# Altium project CYUSB.PrjPcb
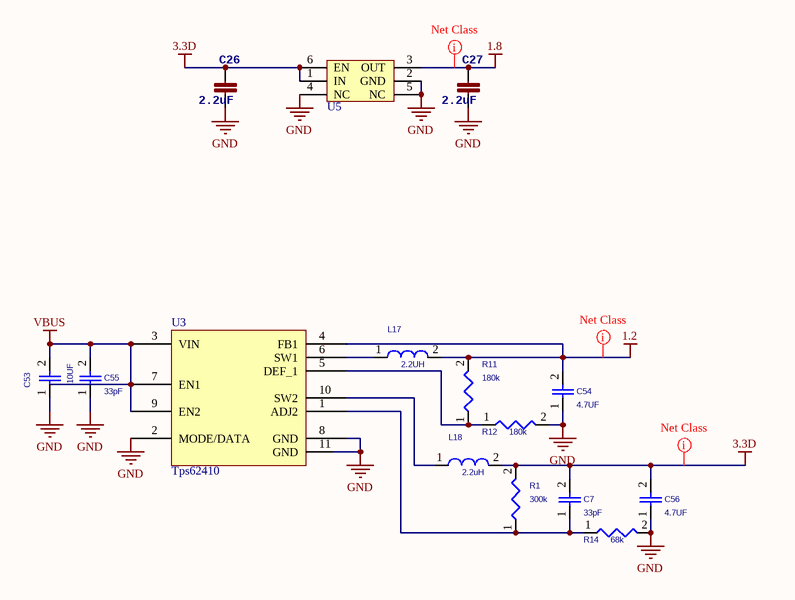
[diagram p0: power.SchDoc]
8 sheets, 127 parts. Net scope: flat (ports and power ports of the same name join across sheets).
Board file: CYUSB.PcbDoc
Sheets:
  power.SchDoc
  USB_TYPE_C.SchDoc
  CYUSB_IO.SchDoc
  CYUSB.SchDoc
  FPGA_IO_Interface.SchDoc
  FPGA_IO_CYUSB.SchDoc
  FPGA_Configuration_power.SchDoc
  connector.SchDoc

## Sheet power.SchDoc
size A4

### Parts
C7  33pF  [0402]
C26  2.2uF  [0402]
C27  2.2uF  [0402]
C53  10UF  [0805]
C54  4.7UF  [0805]
C55  33pF  [0402]
C56  4.7UF  [0805]
L17  2.2UH  [0806]
L18  2.2uH  [0806]
R1  300k  [0402]
R11  180k  [0402]
R12  180k  [0402]
R14  68k  [0402]
U3  Tps62410  [DFN-10P-3X3]
U5  TLV700xx-WSON  [WSON]  (value not drawn)

### Nets
1.2: C54.2 L17.2 R11.2 U3.4(FB1)
1.8: C27.2 U5.3(OUT)
3.3D: C7.2 C26.2 C56.2 L18.2 R1.2 U5.1(IN) U5.6(EN)
GND: C26.1 C27.1 C53.1 C54.1 C55.1 C56.1 R12.2 R14.2 U3.2(MODE/DATA) U3.8(GND) U3.11(GND) U5.2(GND) U5.4(NC) U5.5(NC)
VBUS: C53.2 C55.2 U3.3(VIN) U3.7(EN1) U3.9(EN2)
NetC7_1: C7.1 R1.1 R14.1 U3.1(ADJ2)
NetL17_1: L17.1 U3.6(SW1)
NetL18_1: L18.1 U3.10(SW2)
NetR11_1: R11.1 R12.1 U3.5(DEF_1)

### Layout directives
net class Power: 1.2, 1.8, 3.3D

### Library data of the parts
C7 C55 = CAP/0402: 1st Part Field: 0402
C26 C27 = CAP0402-CAP: <b>Capacitor</b> / Standard 0603 ceramic capacitor, and 0.1" leaded capacitor.; PARTNO: CC0402ZRY5V7BB104
C53 C54 C56 = CAP/0402: 1st Part Field: 0402
L17 L18 = L/2.5*2.0
R1 R11 R12 R14 = RES/0402_3

## Sheet USB_TYPE_C.SchDoc
size A4
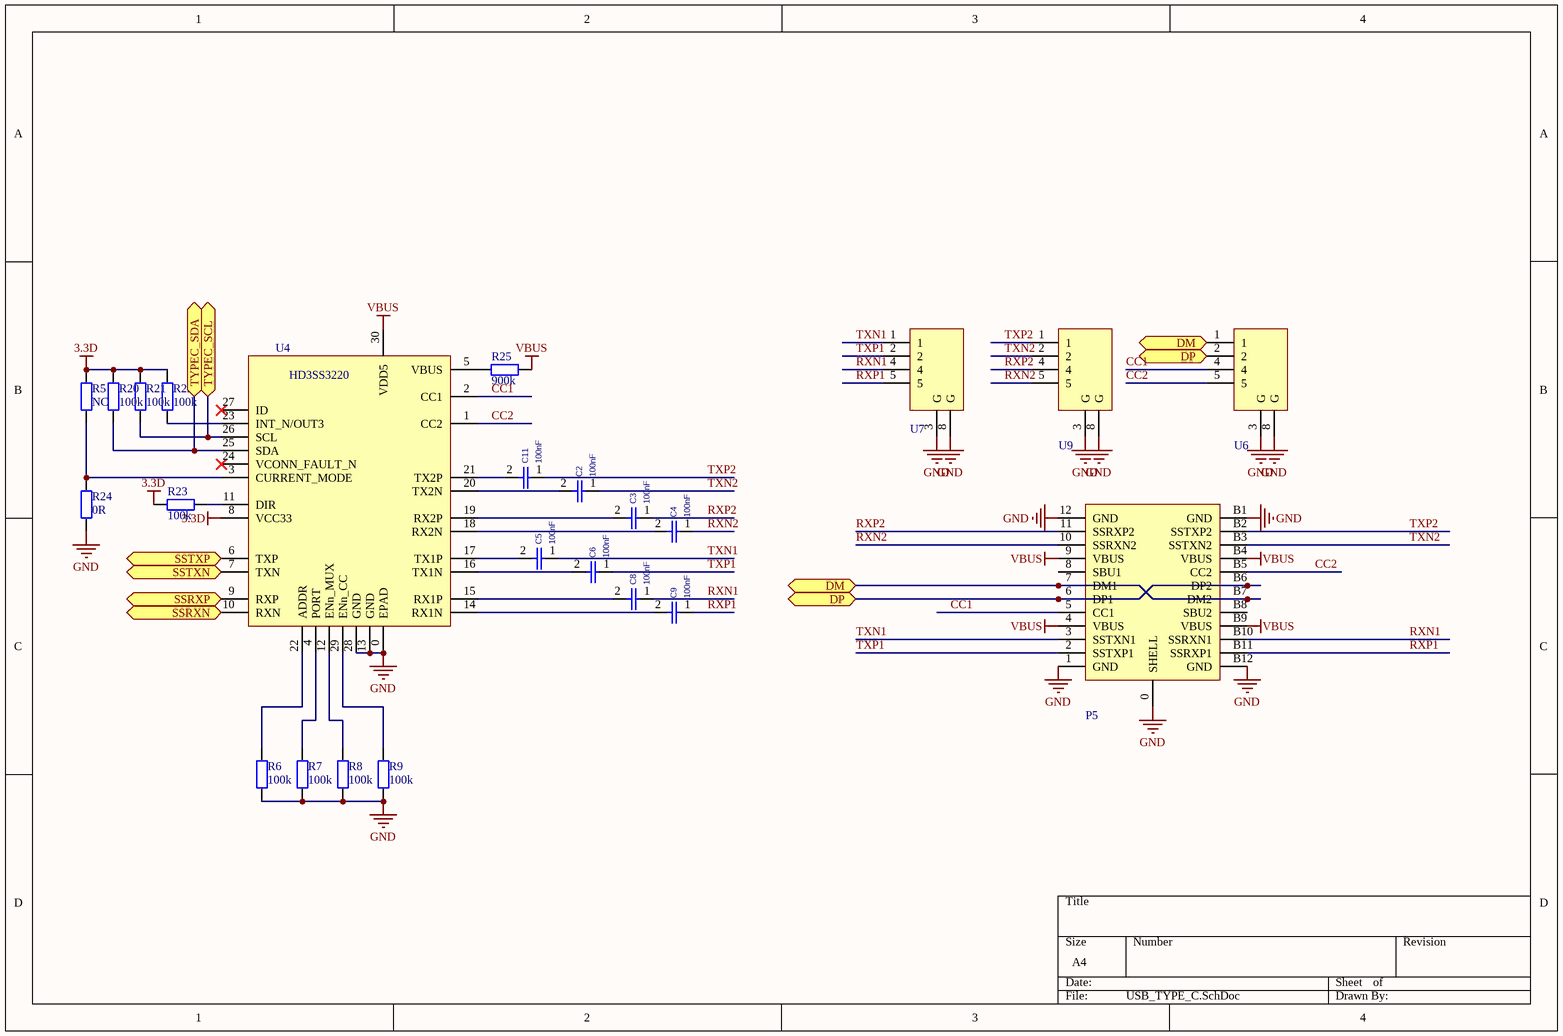
[diagram p1: USB_TYPE_C.SchDoc]

### Parts
C2  100nF  [0201]
C3  100nF  [0201]
C4  100nF  [0201]
C5  100nF  [0201]
C6  100nF  [0201]
C8  100nF  [0201]
C9  100nF  [0201]
C11  100nF  [0201]
P5  TYPEC  [TYPEC]  (value not drawn)
R5  NC  [0201]
R6  100k  [0201]
R7  100k  [0201]
R8  100k  [0201]
R9  100k  [0201]
R20  100k  [0201]
R21  100k  [0201]
R22  100k  [0201]
R23  100k  [0201]
R24  0R  [0201]
R25  900k  [0201]
U4  HD3SS3220  [HD3SS3220]
U6  PUSB3FR4  [PUSB3FR4]  (value not drawn)
U7  PUSB3FR4  [PUSB3FR4]  (value not drawn)
U9  PUSB3FR4  [PUSB3FR4]  (value not drawn)

### Ports
DM, DP, SSRXN, SSRXP, SSTXN, SSTXP, TYPEC_SCL, TYPEC_SDA

### Nets
3.3D: R5.2 R20.2 R21.2 R22.2 R23.1 U4.8(VCC33)
GND: P5.0(SHELL) P5.1(GND) P5.12(GND) P5.B1(GND) P5.B12(GND) R6.1 R7.1 R8.1 R9.1 R24.1 U4.0(EPAD) U4.13(GND) U4.28(GND) U6.3(G) U6.8(G) U7.3(G) U7.8(G) U9.3(G) U9.8(G)
VBUS: P5.4(VBUS) P5.9(VBUS) P5.B4(VBUS) P5.B9(VBUS) R25.2 U4.30(VDD5)
CC1: P5.5(CC1) U4.2(CC1) U6.4
CC2: P5.B5(CC2) U4.1(CC2) U6.5
RXN1: C8.1 P5.B10(SSRXN1) U7.4
RXN2: C4.1 P5.10(SSRXN2) U9.5
RXP1: C9.1 P5.B11(SSRXP1) U7.5
RXP2: C3.1 P5.11(SSRXP2) U9.4
TXN1: C5.1 P5.3(SSTXN1) U7.1
TXN2: C2.1 P5.B3(SSTXN2) U9.2
TXP1: C6.1 P5.2(SSTXP1) U7.2
TXP2: C11.1 P5.B2(SSTXP2) U9.1
NetC2_2: C2.2 U4.20(TX2N)
NetC3_2: C3.2 U4.19(RX2P)
NetC4_2: C4.2 U4.18(RX2N)
NetC5_2: C5.2 U4.17(TX1P)
NetC6_2: C6.2 U4.16(TX1N)
NetC8_2: C8.2 U4.15(RX1P)
NetC9_2: C9.2 U4.14(RX1N)
NetC11_2: C11.2 U4.21(TX2P)
NetP5_6: P5.6(DP1) P5.B6(DP2) U6.2 ; port DP
NetP5_7: P5.7(DM1) P5.B7(DM2) U6.1 ; port DM
NetR4_1: R21.1 U4.26(SCL) ; port TYPEC_SCL
NetR5_1: R5.1 R24.2 U4.3(CURRENT_MODE)
NetR6_2: R6.2 U4.22(ADDR)
NetR7_2: R7.2 U4.4(PORT)
NetR8_2: R8.2 U4.12(ENn_MUX)
NetR9_2: R9.2 U4.29(ENn_CC)
NetR18_1: R20.1 U4.25(SDA) ; port TYPEC_SDA
NetR22_1: R22.1 U4.23(INT_N/OUT3)
NetR23_2: R23.2 U4.11(DIR)
NetR25_1: R25.1 U4.5(VBUS)
NetU1_A3: U4.10(RXN) ; port SSRXN
NetU1_A4: U4.9(RXP) ; port SSRXP
NetU1_A5: U4.6(TXP) ; port SSTXP
NetU1_A6: U4.7(TXN) ; port SSTXN

Not connected (* = marked no-connect by the designer): P5 8(SBU1) B8(SBU2); U4 24(VCONN_FAULT_N)* 27(ID)*

### Library data of the parts
C2-C6 C8 C9 C11 = CAP/0402: 1st Part Field: 0402
R5-R9 R20-R25 = Res2: Resistor; Published: 8-Jun-2000; LatestRevisionDate: 17-Jul-2002; LatestRevisionNote: Re-released for DXP Platform.; PackageReference: AXIAL-0.4; Publisher: Altium Limited; PackageDescription: Axial Device, Thru-Hole; 2 Leads; 0.4 in Pin Spacing

## Sheet CYUSB_IO.SchDoc
size A3
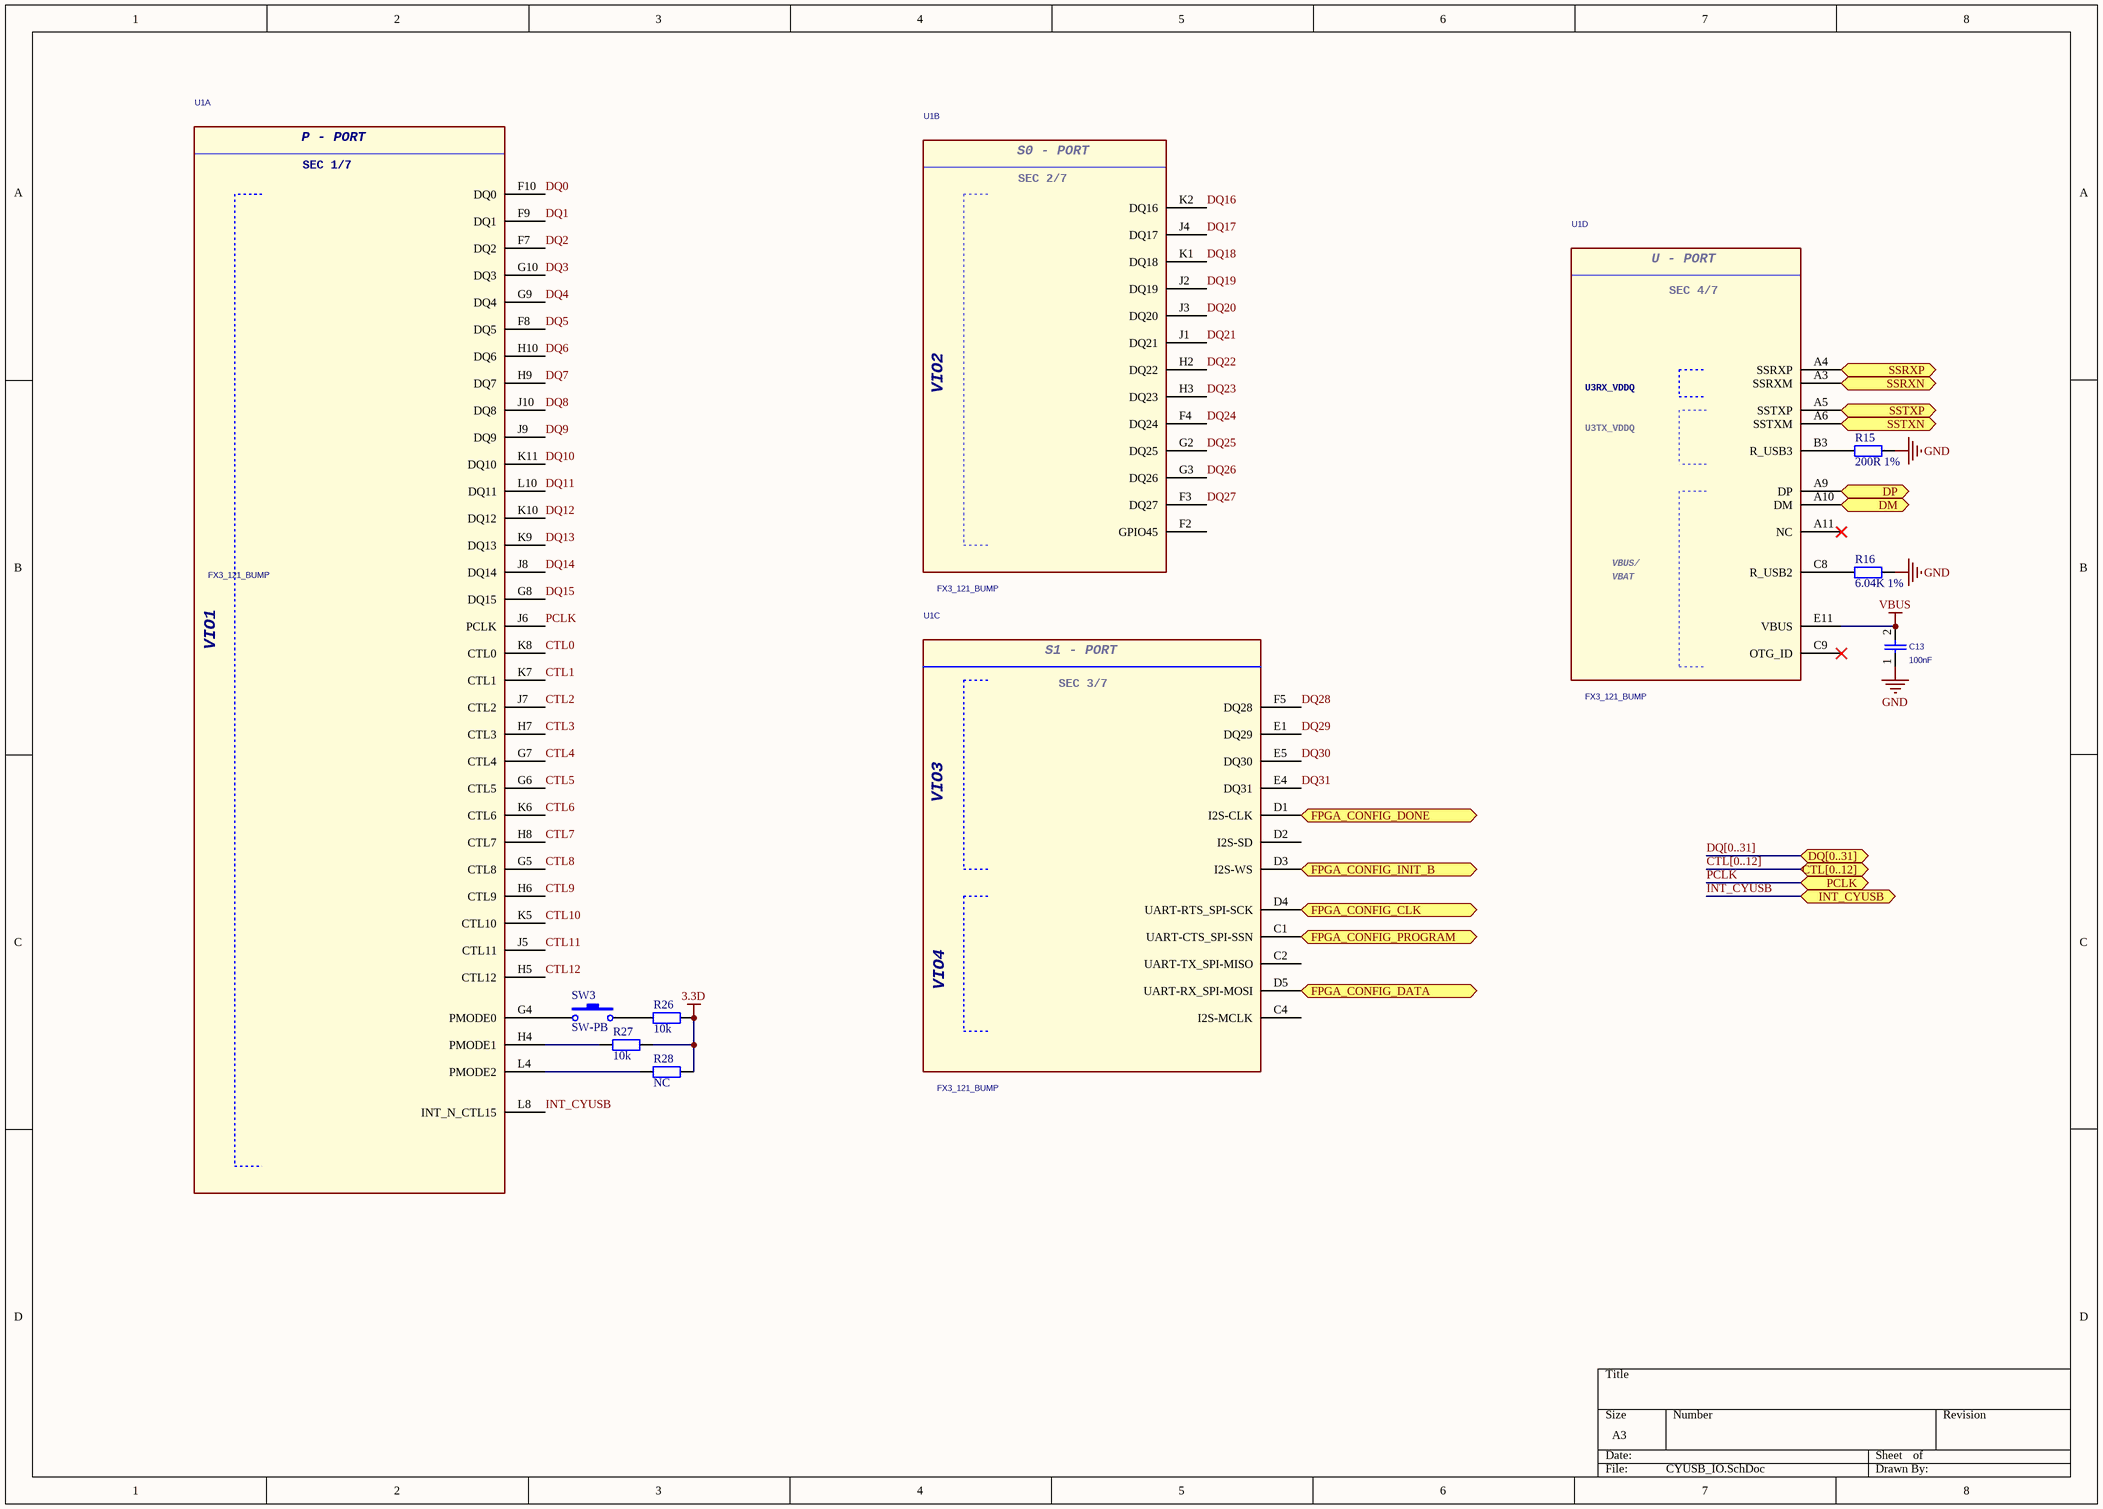
[diagram p2: CYUSB_IO.SchDoc]

### Parts
C13  100nF  [0201]
R15  200R 1%  [0201]
R16  6.04K 1%  [0201]
R26  10k  [0201]
R27  10k  [0201]
R28  NC  [0201]
SW3  SW-PB  [SW-SIDE]
U1  FX3_121_BUMP  [FX3_121_BUMP]  (parts A,B,C,D of 8)

### Ports
CTL[0..12], DM, DP, DQ[0..31], FPGA_CONFIG_CLK, FPGA_CONFIG_DATA, FPGA_CONFIG_DONE, FPGA_CONFIG_INIT_B, FPGA_CONFIG_PROGRAM, INT_CYUSB, PCLK, SSRXN, SSRXP, SSTXN, SSTXP

### Nets
3.3D: R26.1 R27.1 R28.1
GND: C13.1 R15.2 R16.2
VBUS: C13.2 U1.E11(VBUS)
CCLK: U1.D4(UART-RTS_SPI-SCK) ; port FPGA_CONFIG_CLK
CTL0: U1.K8(CTL0)
CTL1: U1.K7(CTL1)
CTL2: U1.J7(CTL2)
CTL3: U1.H7(CTL3)
CTL4: U1.G7(CTL4)
CTL5: U1.G6(CTL5)
CTL6: U1.K6(CTL6)
CTL7: U1.H8(CTL7)
CTL8: U1.G5(CTL8)
CTL9: U1.H6(CTL9)
CTL10: U1.K5(CTL10)
CTL11: U1.J5(CTL11)
CTL12: U1.H5(CTL12)
DATA: U1.D5(UART-RX_SPI-MOSI) ; port FPGA_CONFIG_DATA
DONE: U1.D1(I2S-CLK) ; port FPGA_CONFIG_DONE
DQ0: U1.F10(DQ0)
DQ1: U1.F9(DQ1)
DQ2: U1.F7(DQ2)
DQ3: U1.G10(DQ3)
DQ4: U1.G9(DQ4)
DQ5: U1.F8(DQ5)
DQ6: U1.H10(DQ6)
DQ7: U1.H9(DQ7)
DQ8: U1.J10(DQ8)
DQ9: U1.J9(DQ9)
DQ10: U1.K11(DQ10)
DQ11: U1.L10(DQ11)
DQ12: U1.K10(DQ12)
DQ13: U1.K9(DQ13)
DQ14: U1.J8(DQ14)
DQ15: U1.G8(DQ15)
DQ16: U1.K2(DQ16)
DQ17: U1.J4(DQ17)
DQ18: U1.K1(DQ18)
DQ19: U1.J2(DQ19)
DQ20: U1.J3(DQ20)
DQ21: U1.J1(DQ21)
DQ22: U1.H2(DQ22)
DQ23: U1.H3(DQ23)
DQ24: U1.F4(DQ24)
DQ25: U1.G2(DQ25)
DQ26: U1.G3(DQ26)
DQ27: U1.F3(DQ27)
DQ28: U1.F5(DQ28)
DQ29: U1.E1(DQ29)
DQ30: U1.E5(DQ30)
DQ31: U1.E4(DQ31)
INIT_B: U1.D3(I2S-WS) ; port FPGA_CONFIG_INIT_B
INT_CYUSB: U1.L8(INT_N_CTL15) ; port INT_CYUSB
PCLK: U1.J6(PCLK) ; port PCLK
PROGRAM: U1.C1(UART-CTS_SPI-SSN) ; port FPGA_CONFIG_PROGRAM
NetP5_6: U1.A9(DP) ; port DP
NetP5_7: U1.A10(DM) ; port DM
NetR15_1: R15.1 U1.B3(R_USB3)
NetR16_1: R16.1 U1.C8(R_USB2)
NetR26_2: R26.2 SW3.2
NetR27_2: R27.2 U1.H4(PMODE1)
NetR28_2: R28.2 U1.L4(PMODE2)
NetSW3_1: SW3.1 U1.G4(PMODE0)
NetU1_A3: U1.A3(SSRXM) ; port SSRXN
NetU1_A4: U1.A4(SSRXP) ; port SSRXP
NetU1_A5: U1.A5(SSTXP) ; port SSTXP
NetU1_A6: U1.A6(SSTXM) ; port SSTXN

Not connected (* = marked no-connect by the designer): U1 A11(NC)* C2(UART-TX_SPI-MISO) C4(I2S-MCLK) C9(OTG_ID)* D2(I2S-SD) F2(GPIO45)

### Buses and harness runs
bus CTL[0..12] = port CTL[0..12]
bus DQ[0..31] = port DQ[0..31]

### Notes on the sheet
- (in symbol FX3_121_BUMP_10, part A) P - PORT; SEC 1/7; VIO1
- (in symbol FX3_121_BUMP_10, part B) S0 - PORT; SEC 2/7
- (in symbol FX3_121_BUMP_10, part C) S1 - PORT; SEC 3/7
- (in symbol FX3_121_BUMP_10, part D) U - PORT; SEC 4/7; U3RX_VDDQ; U3TX_VDDQ; VBUS/

### Library data of the parts
C13 = CAP/0402: 1st Part Field: 0402
R15 R16 R26-R28 = Res2: Resistor; Published: 8-Jun-2000; LatestRevisionDate: 17-Jul-2002; LatestRevisionNote: Re-released for DXP Platform.; PackageReference: AXIAL-0.4; Publisher: Altium Limited; PackageDescription: Axial Device, Thru-Hole; 2 Leads; 0.4 in Pin Spacing
SW3 = SW-PB: Switch; Published: 24-Mar-1999; LatestRevisionDate: 17-Jul-2002; LatestRevisionNote: Re-released for DXP Platform.; PackageReference: SPST-2; Publisher: Altium Limited; PackageDescription: Switch; 2 Leads
U1 = FX3_121_BUMP_10: FX3; Manufacturer: Cypress

## Sheet CYUSB.SchDoc
size A3
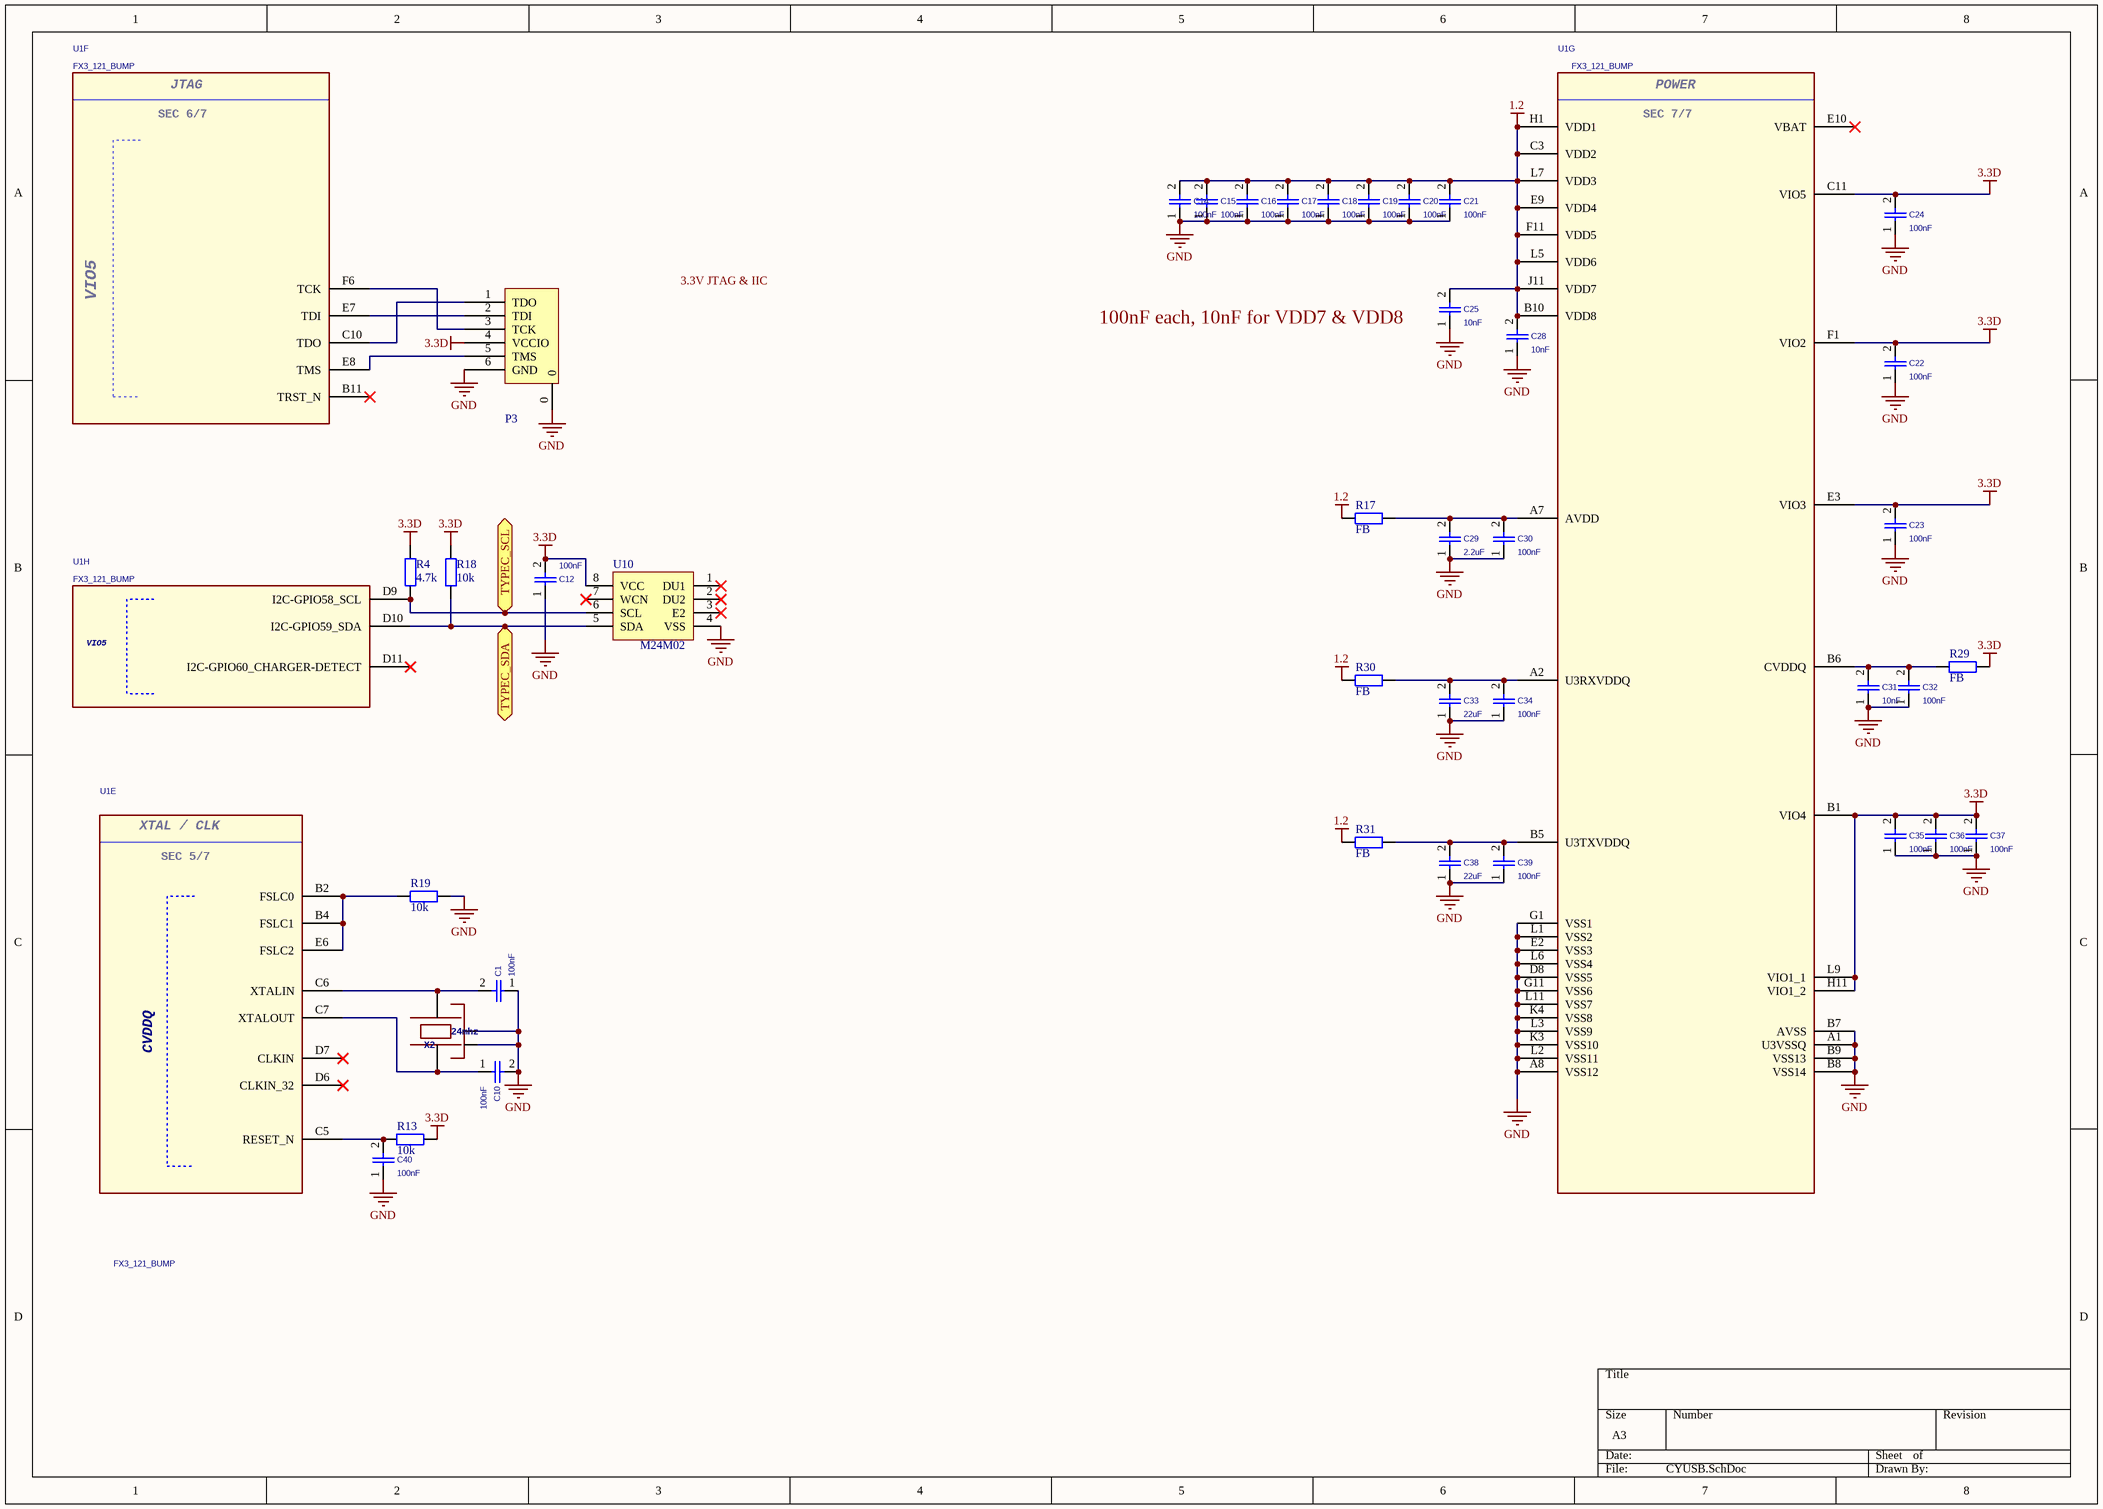
[diagram p3: CYUSB.SchDoc]

### Parts
C1  100nF  [0201]
C10  100nF  [0201]
C12  100nF  [0201]
C14  100nF  [0201]
C15  100nF  [0201]
C16  100nF  [0201]
C17  100nF  [0201]
C18  100nF  [0201]
C19  100nF  [0201]
C20  100nF  [0201]
C21  100nF  [0201]
C22  100nF  [0201]
C23  100nF  [0201]
C24  100nF  [0201]
C25  10nF  [0201]
C28  10nF  [0201]
C29  2.2uF  [0201]
C30  100nF  [0201]
C31  10nF  [0201]
C32  100nF  [0201]
C33  22uF  [0603L]
C34  100nF  [0201]
C35  100nF  [0201]
C36  100nF  [0201]
C37  100nF  [0201]
C38  22uF  [0603L]
C39  100nF  [0201]
C40  100nF  [0201]
P3  JTAG-6P  [GH1.25-6]  (value not drawn)
R4  4.7k  [0201]
R13  10k  [0201]
R17  FB  [0402]
R18  10k  [0201]
R19  10k  [0201]
R29  FB  [0402]
R30  FB  [0402]
R31  FB  [0402]
U1  FX3_121_BUMP  [FX3_121_BUMP]  (parts E,F,G,H of 8)
U10  M24M02  [SO8]
X2  24mhz  [OSCILLATOR-2.5x2.0]

### Ports
TYPEC_SCL, TYPEC_SDA

### Nets
1.2: C14.2 C15.2 C16.2 C17.2 C18.2 C19.2 C20.2 C21.2 C25.2 C28.2 R17.2 R30.2 R31.2 U1.B10(VDD8) U1.C3(VDD2) U1.E9(VDD4) U1.F11(VDD5) U1.H1(VDD1) U1.J11(VDD7) U1.L5(VDD6) U1.L7(VDD3)
3.3D: C12.2 C22.2 C23.2 C24.2 C35.2 C36.2 C37.2 P3.4(VCCIO) R4.2 R13.2 R18.2 R29.1 U1.B1(VIO4) U1.C11(VIO5) U1.E3(VIO3) U1.F1(VIO2) U1.H11(VIO1_2) U1.L9(VIO1_1) U10.8(VCC)
GND: C1.1 C10.2 C12.1 C14.1 C15.1 C16.1 C17.1 C18.1 C19.1 C20.1 C21.1 C22.1 C23.1 C24.1 C25.1 C28.1 C29.1 C30.1 C31.1 C32.1 C33.1 C34.1 C35.1 C36.1 C37.1 C38.1 C39.1 C40.1 P3.0 P3.6(GND) R19.2 U1.A1(U3VSSQ) U1.A8(VSS12) U1.B7(AVSS) U1.B8(VSS14) U1.B9(VSS13) U1.D8(VSS5) U1.E2(VSS3) U1.G1(VSS1) U1.G11(VSS6) U1.K3(VSS10) U1.K4(VSS8) U1.L1(VSS2) U1.L2(VSS11) U1.L3(VSS9) U1.L6(VSS4) U1.L11(VSS7) U10.4(VSS) X2.2(NC_2) X2.4(NC_4)
NetC1_2: C1.2 U1.C6(XTALIN) X2.3
NetC10_1: C10.1 U1.C7(XTALOUT) X2.1
NetC29_2: C29.2 C30.2 R17.1 U1.A7(AVDD)
NetC31_2: C31.2 C32.2 R29.2 U1.B6(CVDDQ)
NetC33_2: C33.2 C34.2 R30.1 U1.A2(U3RXVDDQ)
NetC38_2: C38.2 C39.2 R31.1 U1.B5(U3TXVDDQ)
NetC40_2: C40.2 R13.1 U1.C5(RESET_N)
NetP3_1: P3.1(TDO) U1.C10(TDO)
NetP3_2: P3.2(TDI) U1.E7(TDI)
NetP3_3: P3.3(TCK) U1.F6(TCK)
NetP3_5: P3.5(TMS) U1.E8(TMS)
NetR4_1: R4.1 U1.D9(I2C-GPIO58_SCL) U10.6(SCL) ; port TYPEC_SCL
NetR18_1: R18.1 U1.D10(I2C-GPIO59_SDA) U10.5(SDA) ; port TYPEC_SDA
NetR19_1: R19.1 U1.B2(FSLC0) U1.B4(FSLC1) U1.E6(FSLC2)

Not connected (* = marked no-connect by the designer): U1 B11(TRST_N)* D6(CLKIN_32)* D7(CLKIN)* D11(I2C-GPIO60_CHARGER-DETECT)* E10(VBAT)*; U10 1(DU1)* 2(DU2)* 3(E2)* 7(WCN)*

### Notes on the sheet
- (near C25) 100nF each, 10nF for VDD7 & VDD8
- Labels drawn without touching a wire or pin: 3.3V JTAG & IIC
- (in symbol FX3_121_BUMP_10, part E) XTAL / CLK; SEC 5/7
- (in symbol FX3_121_BUMP_10, part F) JTAG; SEC 6/7
- (in symbol FX3_121_BUMP_10, part G) POWER; SEC 7/7

### Library data of the parts
C1 C10 C12 C14-C25 C28-C40 = CAP/0402: 1st Part Field: 0402
R4 R13 R17-R19 R29-R31 = Res2: Resistor; Published: 8-Jun-2000; LatestRevisionDate: 17-Jul-2002; LatestRevisionNote: Re-released for DXP Platform.; PackageReference: AXIAL-0.4; Publisher: Altium Limited; PackageDescription: Axial Device, Thru-Hole; 2 Leads; 0.4 in Pin Spacing
U1 = FX3_121_BUMP_10: FX3; Manufacturer: Cypress
X2 = OSCILLATOR-3.2X2.5: Crystal Oscillator in 3.2x2.5 SMD

## Sheet FPGA_IO_Interface.SchDoc
size A4
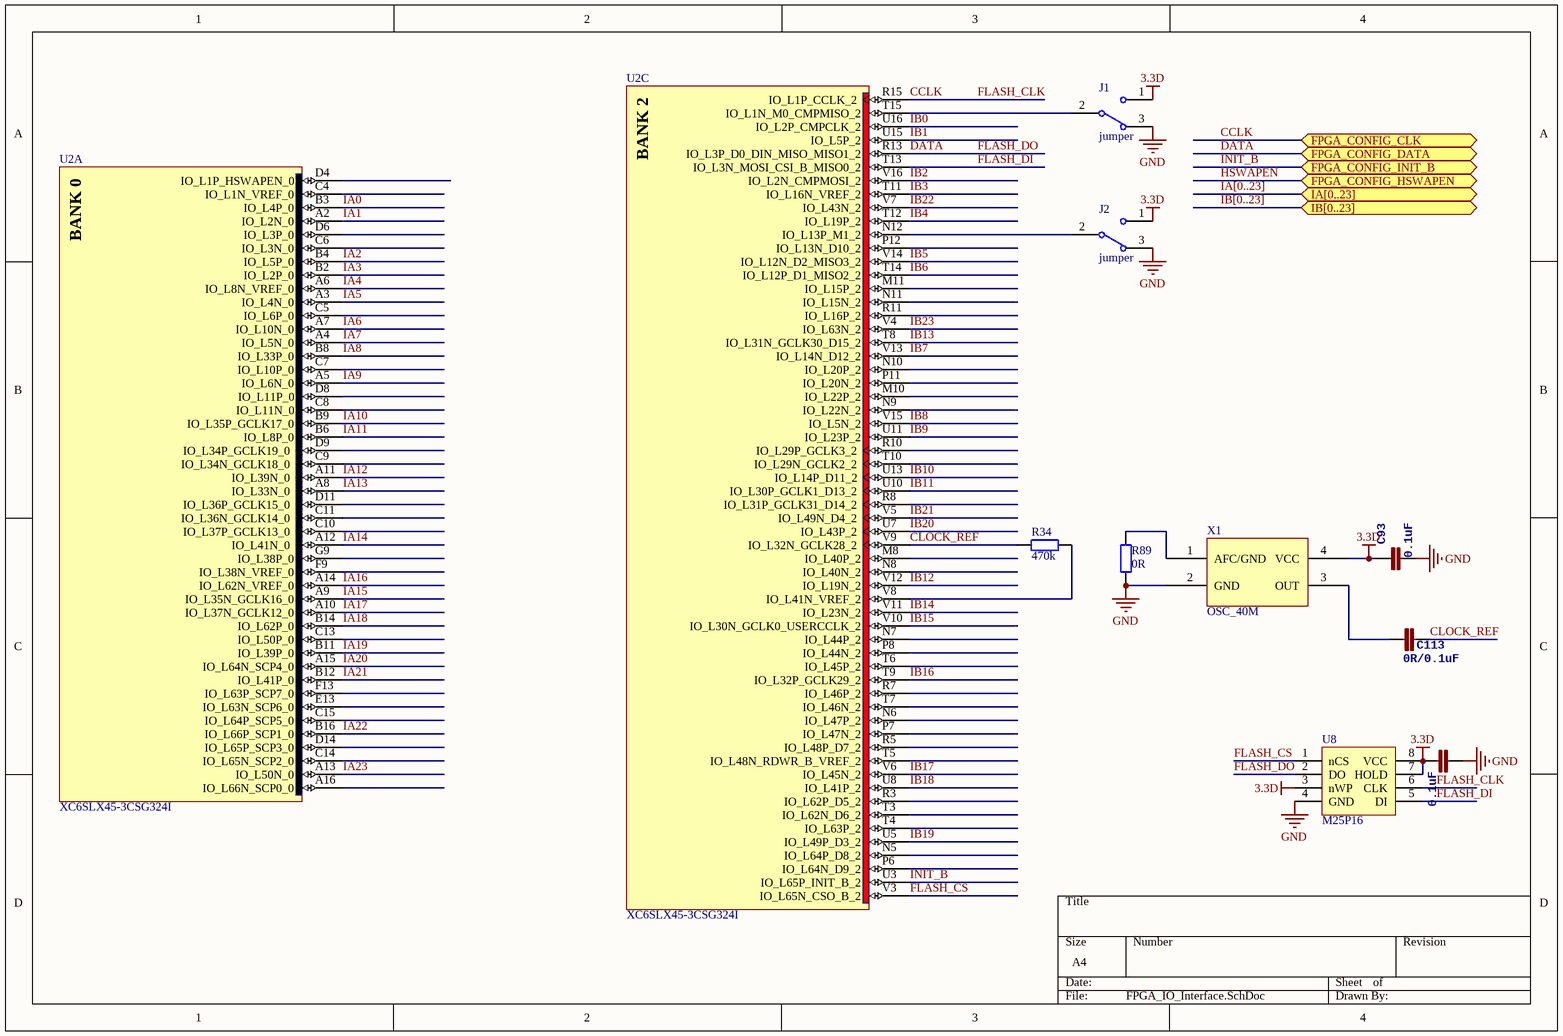
[diagram p4: FPGA_IO_Interface.SchDoc]

### Parts
C68  0.1uF  [0402]
C93  0.1uF  [0402]
C113  0R/0.1uF  [0402]
J1  jumper  [0402J]
J2  jumper  [0402J]
R34  470k  [0402]
R89  0R  [0402]
U2  XC6SLX45-3CSG324I  [CSG324]  (parts A,C of 8)
U8  M25P16  [SO8]
X1  OSC_40M  [TXC_7Q]

### Ports
FPGA_CONFIG_CLK, FPGA_CONFIG_DATA, FPGA_CONFIG_HSWAPEN, FPGA_CONFIG_INIT_B, IA[0..23], IB[0..23]

### Nets
3.3D: C68.2 C93.1 J1.1 J2.1 U8.3(nWP) U8.7(HOLD) U8.8(VCC) X1.4(VCC)
GND: C68.1 C93.2 J1.3 J2.3 R89.2 U8.4(GND) X1.2(GND)
CCLK: U2.R15(IO_L1P_CCLK_2) U8.6(CLK) ; port FPGA_CONFIG_CLK  [also labelled FLASH_CLK]
CLOCK_REF: C113.2 R34.1 U2.V9(IO_L32N_GCLK28_2)
DATA: U2.R13(IO_L3P_D0_DIN_MISO_MISO1_2) U8.2(DO) ; port FPGA_CONFIG_DATA  [also labelled FLASH_DO]
FLASH_CS: U2.V3(IO_L65N_CSO_B_2) U8.1(nCS)
FLASH_DI: U2.T13(IO_L3N_MOSI_CSI_B_MISO0_2) U8.5(DI)
HSWAPEN: port FPGA_CONFIG_HSWAPEN
IA0: U2.B3(IO_L4P_0)
IA1: U2.A2(IO_L2N_0)
IA2: U2.B4(IO_L5P_0)
IA3: U2.B2(IO_L2P_0)
IA4: U2.A6(IO_L8N_VREF_0)
IA5: U2.A3(IO_L4N_0)
IA6: U2.A7(IO_L10N_0)
IA7: U2.A4(IO_L5N_0)
IA8: U2.B8(IO_L33P_0)
IA9: U2.A5(IO_L6N_0)
IA10: U2.B9(IO_L35P_GCLK17_0)
IA11: U2.B6(IO_L8P_0)
IA12: U2.A11(IO_L39N_0)
IA13: U2.A8(IO_L33N_0)
IA14: U2.A12(IO_L41N_0)
IA15: U2.A9(IO_L35N_GCLK16_0)
IA16: U2.A14(IO_L62N_VREF_0)
IA17: U2.A10(IO_L37N_GCLK12_0)
IA18: U2.B14(IO_L62P_0)
IA19: U2.B11(IO_L39P_0)
IA20: U2.A15(IO_L64N_SCP4_0)
IA21: U2.B12(IO_L41P_0)
IA22: U2.B16(IO_L66P_SCP1_0)
IA23: U2.A13(IO_L50N_0)
IB0: U2.U16(IO_L2P_CMPCLK_2)
IB1: U2.U15(IO_L5P_2)
IB2: U2.V16(IO_L2N_CMPMOSI_2)
IB3: U2.T11(IO_L16N_VREF_2)
IB4: U2.T12(IO_L19P_2)
IB5: U2.V14(IO_L12N_D2_MISO3_2)
IB6: U2.T14(IO_L12P_D1_MISO2_2)
IB7: U2.V13(IO_L14N_D12_2)
IB8: U2.V15(IO_L5N_2)
IB9: U2.U11(IO_L23P_2)
IB10: U2.U13(IO_L14P_D11_2)
IB11: U2.U10(IO_L30P_GCLK1_D13_2)
IB12: U2.V12(IO_L19N_2)
IB13: U2.T8(IO_L31N_GCLK30_D15_2)
IB14: U2.V11(IO_L23N_2)
IB15: U2.V10(IO_L30N_GCLK0_USERCCLK_2)
IB16: U2.T9(IO_L32P_GCLK29_2)
IB17: U2.V6(IO_L45N_2)
IB18: U2.U8(IO_L41P_2)
IB19: U2.U5(IO_L49P_D3_2)
IB20: U2.U7(IO_L43P_2)
IB21: U2.V5(IO_L49N_D4_2)
IB22: U2.V7(IO_L43N_2)
IB23: U2.V4(IO_L63N_2)
INIT_B: U2.U3(IO_L65P_INIT_B_2) ; port FPGA_CONFIG_INIT_B
NetC113_1: C113.1 X1.3(OUT)
NetJ1_2: J1.2 U2.T15(IO_L1N_M0_CMPMISO_2)
NetJ2_2: J2.2 U2.N12(IO_L13P_M1_2)
NetR34_2: R34.2 U2.V8(IO_L41N_VREF_2)
NetR89_1: R89.1 X1.1(AFC/GND)

Not connected (* = marked no-connect by the designer): U2 A16(IO_L66N_SCP0_0) C4(IO_L1N_VREF_0) C5(IO_L6P_0) C6(IO_L3N_0) C7(IO_L10P_0) C8(IO_L11N_0) C9(IO_L34N_GCLK18_0) C10(IO_L37P_GCLK13_0) C11(IO_L36N_GCLK14_0) C13(IO_L50P_0) C14(IO_L65N_SCP2_0) C15(IO_L64P_SCP5_0) D4(IO_L1P_HSWAPEN_0) D6(IO_L3P_0) D8(IO_L11P_0) D9(IO_L34P_GCLK19_0) D11(IO_L36P_GCLK15_0) D14(IO_L65P_SCP3_0) E13(IO_L63N_SCP6_0) F9(IO_L38N_VREF_0) F13(IO_L63P_SCP7_0) G9(IO_L38P_0) M8(IO_L40P_2) M10(IO_L22P_2) M11(IO_L15P_2) N5(IO_L64P_D8_2) N6(IO_L47P_2) N7(IO_L44P_2) N8(IO_L40N_2) N9(IO_L22N_2) N10(IO_L20P_2) N11(IO_L15N_2) P6(IO_L64N_D9_2) P7(IO_L47N_2) P8(IO_L44N_2) P11(IO_L20N_2) P12(IO_L13N_D10_2) R3(IO_L62P_D5_2) R5(IO_L48P_D7_2) R7(IO_L46P_2) R8(IO_L31P_GCLK31_D14_2) R10(IO_L29P_GCLK3_2) R11(IO_L16P_2) T3(IO_L62N_D6_2) T4(IO_L63P_2) T5(IO_L48N_RDWR_B_VREF_2) T6(IO_L45P_2) T7(IO_L46N_2) T10(IO_L29N_GCLK2_2)

### Buses and harness runs
bus IA[0..23] = port IA[0..23]
bus IB[0..23] = port IB[0..23]

### Notes on the sheet
- (in symbol XC6SLX45-3CSG324I, part A) BANK 0
- (in symbol XC6SLX45-3CSG324I, part C) BANK 2

### Library data of the parts
C68 C93 C113 = CAP0402-CAP: as C26 on sheet power
J1 J2 = SW-SPDT: SPDT Subminiature Toggle Switch, Right Angle Mounting, Vertical Actuation; Published: 24-Mar-1999; LatestRevisionDate: 17-Dec-2003; LatestRevisionNote: Schematic revised, PCB Footprint replaced.; DatasheetVersion: 05-Dec-2000; PackageReference: TL36WW15050; Publisher: Altium Limited; PackageDescription: Switch; 4 Leads; ComponentLink1Description: Manufacturer Link; ComponentLink1URL: http://www.apem.com
R34 R89 = Res2: Resistor; Value: 0Ohm; Published: 8-Jun-2000; LatestRevisionDate: 17-Jul-2002; LatestRevisionNote: Re-released for DXP Platform.; PackageReference: AXIAL-0.4; Publisher: Altium Limited; PackageDescription: Axial Device, Thru-Hole; 2 Leads; 0.4 in Pin Spacing
U2 = XC6SLX45-3CSG324I: Spartan-6 LX 1.2V FPGA, 218 User I/Os, 324-Ball Chip-Scale BGA (0.8mm Pitch), Speed Grade 3, Industrial Grade, Pb-Free; Published: 17-Nov-2009; DatasheetVersion: ver1.6, Nov-2010; PackageVersion: ver1.1, Nov-2009; PackageReference: CSG324; Publisher: Altium Limited; PackageDescription: 324-Ball Chip-Scale BGA (CSG324) Package, 0.8 mm Pitch; Supplier 1: Digi-Key; Supplier Part Number 1: XC6SLX45-3CSG324I-ND; Code_JEDEC: MO-275-KKAC-1; ComponentLink1Description: Manufacturer Link; ComponentLink1URL: http://www.xilinx.com; ComponentLink2Description: Spartan-6 Datasheet; ComponentLink2URL: http://www.xilinx.com/support/documentation/data_sheets/ds160.pdf; ComponentLink3Description: Spartan-6 Documents; ComponentLink3URL: http://www.xilinx.com/support/documentation/spartan-6.htm; ComponentLink4Description: Xilinx.com Home; ComponentLink4URL: http://www.xilinx.com

## Sheet FPGA_IO_CYUSB.SchDoc
size A4
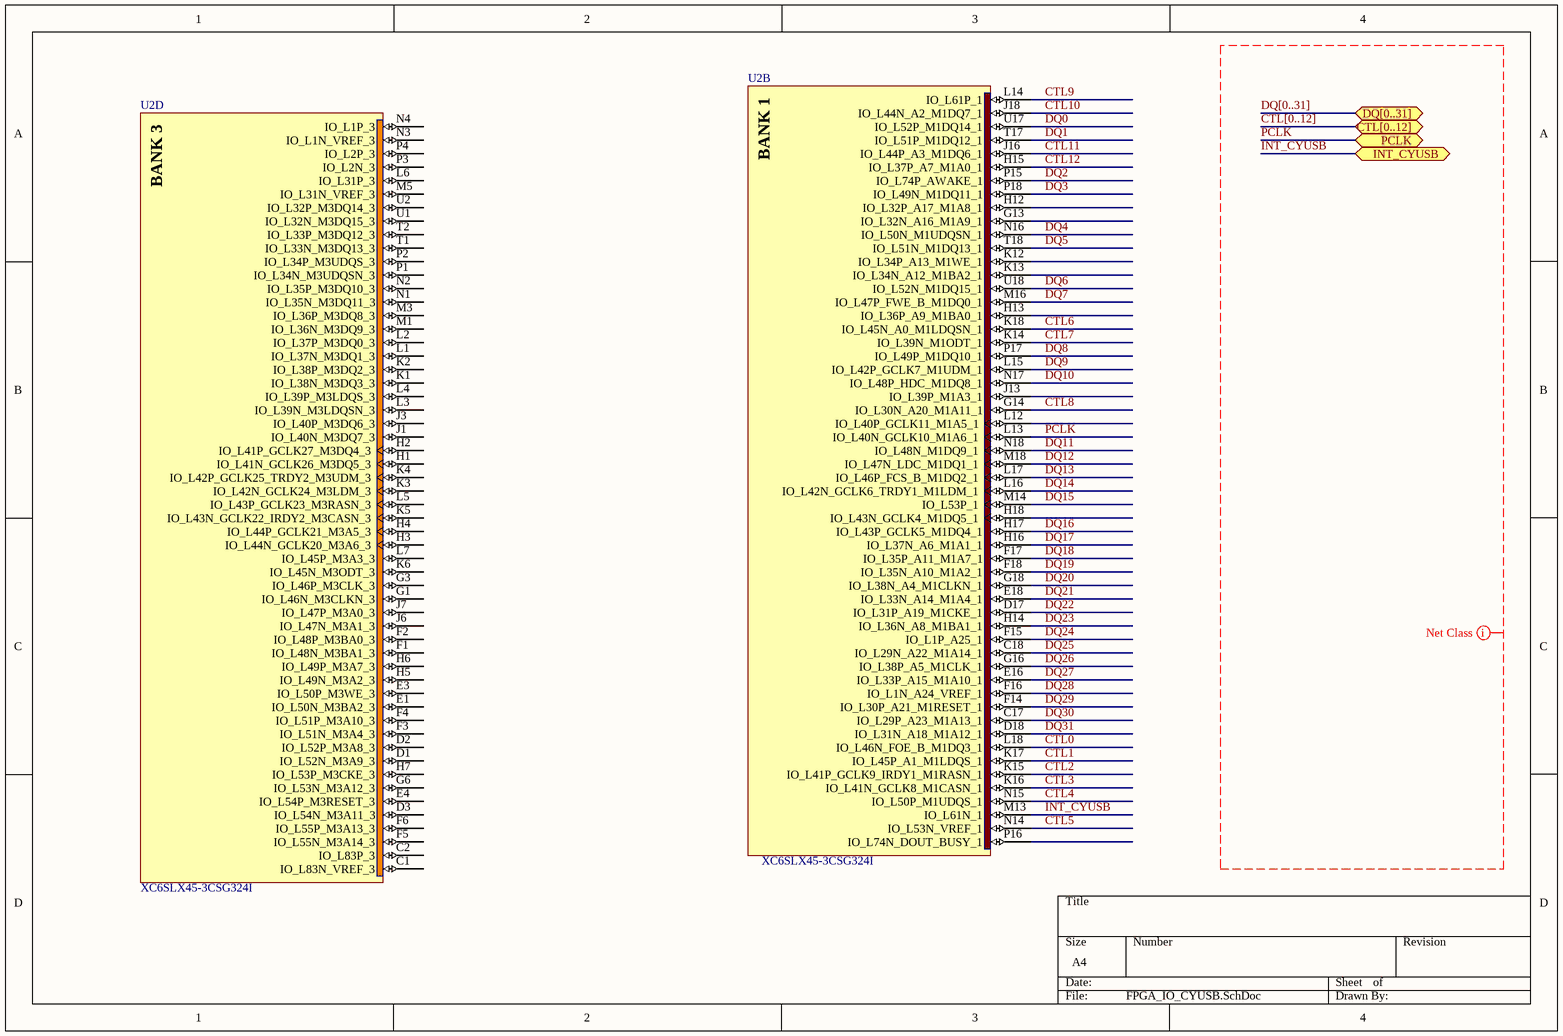
[diagram p5: FPGA_IO_CYUSB.SchDoc]

### Parts
U2  XC6SLX45-3CSG324I  [CSG324]  (parts B,D of 8)

### Ports
CTL[0..12], DQ[0..31], INT_CYUSB, PCLK

### Nets
CTL0: U2.L18(IO_L46N_FOE_B_M1DQ3_1)
CTL1: U2.K17(IO_L45P_A1_M1LDQS_1)
CTL2: U2.K15(IO_L41P_GCLK9_IRDY1_M1RASN_1)
CTL3: U2.K16(IO_L41N_GCLK8_M1CASN_1)
CTL4: U2.N15(IO_L50P_M1UDQS_1)
CTL5: U2.N14(IO_L53N_VREF_1)
CTL6: U2.K18(IO_L45N_A0_M1LDQSN_1)
CTL7: U2.K14(IO_L39N_M1ODT_1)
CTL8: U2.G14(IO_L30N_A20_M1A11_1)
CTL9: U2.L14(IO_L61P_1)
CTL10: U2.J18(IO_L44N_A2_M1DQ7_1)
CTL11: U2.J16(IO_L44P_A3_M1DQ6_1)
CTL12: U2.H15(IO_L37P_A7_M1A0_1)
DQ0: U2.U17(IO_L52P_M1DQ14_1)
DQ1: U2.T17(IO_L51P_M1DQ12_1)
DQ2: U2.P15(IO_L74P_AWAKE_1)
DQ3: U2.P18(IO_L49N_M1DQ11_1)
DQ4: U2.N16(IO_L50N_M1UDQSN_1)
DQ5: U2.T18(IO_L51N_M1DQ13_1)
DQ6: U2.U18(IO_L52N_M1DQ15_1)
DQ7: U2.M16(IO_L47P_FWE_B_M1DQ0_1)
DQ8: U2.P17(IO_L49P_M1DQ10_1)
DQ9: U2.L15(IO_L42P_GCLK7_M1UDM_1)
DQ10: U2.N17(IO_L48P_HDC_M1DQ8_1)
DQ11: U2.N18(IO_L48N_M1DQ9_1)
DQ12: U2.M18(IO_L47N_LDC_M1DQ1_1)
DQ13: U2.L17(IO_L46P_FCS_B_M1DQ2_1)
DQ14: U2.L16(IO_L42N_GCLK6_TRDY1_M1LDM_1)
DQ15: U2.M14(IO_L53P_1)
DQ16: U2.H17(IO_L43P_GCLK5_M1DQ4_1)
DQ17: U2.H16(IO_L37N_A6_M1A1_1)
DQ18: U2.F17(IO_L35P_A11_M1A7_1)
DQ19: U2.F18(IO_L35N_A10_M1A2_1)
DQ20: U2.G18(IO_L38N_A4_M1CLKN_1)
DQ21: U2.E18(IO_L33N_A14_M1A4_1)
DQ22: U2.D17(IO_L31P_A19_M1CKE_1)
DQ23: U2.H14(IO_L36N_A8_M1BA1_1)
DQ24: U2.F15(IO_L1P_A25_1)
DQ25: U2.C18(IO_L29N_A22_M1A14_1)
DQ26: U2.G16(IO_L38P_A5_M1CLK_1)
DQ27: U2.E16(IO_L33P_A15_M1A10_1)
DQ28: U2.F16(IO_L1N_A24_VREF_1)
DQ29: U2.F14(IO_L30P_A21_M1RESET_1)
DQ30: U2.C17(IO_L29P_A23_M1A13_1)
DQ31: U2.D18(IO_L31N_A18_M1A12_1)
INT_CYUSB: U2.M13(IO_L61N_1) ; port INT_CYUSB
PCLK: U2.L13(IO_L40N_GCLK10_M1A6_1) ; port PCLK

Not connected (* = marked no-connect by the designer): U2 C1(IO_L83N_VREF_3) C2(IO_L83P_3) D1(IO_L52N_M3A9_3) D2(IO_L52P_M3A8_3) D3(IO_L54N_M3A11_3) E1(IO_L50N_M3BA2_3) E3(IO_L50P_M3WE_3) E4(IO_L54P_M3RESET_3) F1(IO_L48N_M3BA1_3) F2(IO_L48P_M3BA0_3) F3(IO_L51N_M3A4_3) F4(IO_L51P_M3A10_3) F5(IO_L55N_M3A14_3) F6(IO_L55P_M3A13_3) G1(IO_L46N_M3CLKN_3) G3(IO_L46P_M3CLK_3) G6(IO_L53N_M3A12_3) G13(IO_L32N_A16_M1A9_1) H1(IO_L41N_GCLK26_M3DQ5_3) H2(IO_L41P_GCLK27_M3DQ4_3) H3(IO_L44N_GCLK20_M3A6_3) H4(IO_L44P_GCLK21_M3A5_3) H5(IO_L49N_M3A2_3) H6(IO_L49P_M3A7_3) H7(IO_L53P_M3CKE_3) H12(IO_L32P_A17_M1A8_1) H13(IO_L36P_A9_M1BA0_1) H18(IO_L43N_GCLK4_M1DQ5_1) J1(IO_L40N_M3DQ7_3) J3(IO_L40P_M3DQ6_3) J6(IO_L47N_M3A1_3) J7(IO_L47P_M3A0_3) J13(IO_L39P_M1A3_1) K1(IO_L38N_M3DQ3_3) K2(IO_L38P_M3DQ2_3) K3(IO_L42N_GCLK24_M3LDM_3) K4(IO_L42P_GCLK25_TRDY2_M3UDM_3) K5(IO_L43N_GCLK22_IRDY2_M3CASN_3) K6(IO_L45N_M3ODT_3) K12(IO_L34P_A13_M1WE_1) K13(IO_L34N_A12_M1BA2_1) L1(IO_L37N_M3DQ1_3) L2(IO_L37P_M3DQ0_3) L3(IO_L39N_M3LDQSN_3) L4(IO_L39P_M3LDQS_3) L5(IO_L43P_GCLK23_M3RASN_3) L6(IO_L31P_3) L7(IO_L45P_M3A3_3) L12(IO_L40P_GCLK11_M1A5_1) M1(IO_L36N_M3DQ9_3) M3(IO_L36P_M3DQ8_3) M5(IO_L31N_VREF_3) N1(IO_L35N_M3DQ11_3) N2(IO_L35P_M3DQ10_3) N3(IO_L1N_VREF_3) N4(IO_L1P_3) P1(IO_L34N_M3UDQSN_3) P2(IO_L34P_M3UDQS_3) P3(IO_L2N_3) P4(IO_L2P_3) P16(IO_L74N_DOUT_BUSY_1) T1(IO_L33N_M3DQ13_3) T2(IO_L33P_M3DQ12_3) U1(IO_L32N_M3DQ15_3) U2(IO_L32P_M3DQ14_3)

### Buses and harness runs
bus CTL[0..12] = port CTL[0..12]
bus DQ[0..31] = port DQ[0..31]

### Layout directives
net class CYUSB: CTL[0..12], DQ[0..31], INT_CYUSB, PCLK

### Notes on the sheet
- (in symbol XC6SLX45-3CSG324I, part B) BANK 1
- (in symbol XC6SLX45-3CSG324I, part D) BANK 3

### Library data of the parts
U2 = XC6SLX45-3CSG324I: as U2 on sheet FPGA_IO_Interface; Published: 17-Nov-2009; DatasheetVersion: ver1.6, Nov-2010; PackageVersion: ver1.1, Nov-2009; PackageReference: CSG324; Publisher: Altium Limited; PackageDescription: 324-Ball Chip-Scale BGA (CSG324) Package, 0.8 mm Pitch; Supplier 1: Digi-Key; Supplier Part Number 1: XC6SLX45-3CSG324I-ND; Code_JEDEC: MO-275-KKAC-1; ComponentLink1Description: Manufacturer Link; ComponentLink1URL: http://www.xilinx.com; ComponentLink2Description: Spartan-6 Datasheet; ComponentLink2URL: http://www.xilinx.com/support/documentation/data_sheets/ds160.pdf; ComponentLink3Description: Spartan-6 Documents; ComponentLink3URL: http://www.xilinx.com/support/documentation/spartan-6.htm; ComponentLink4Description: Xilinx.com Home; ComponentLink4URL: http://www.xilinx.com

## Sheet FPGA_Configuration_power.SchDoc
size A4
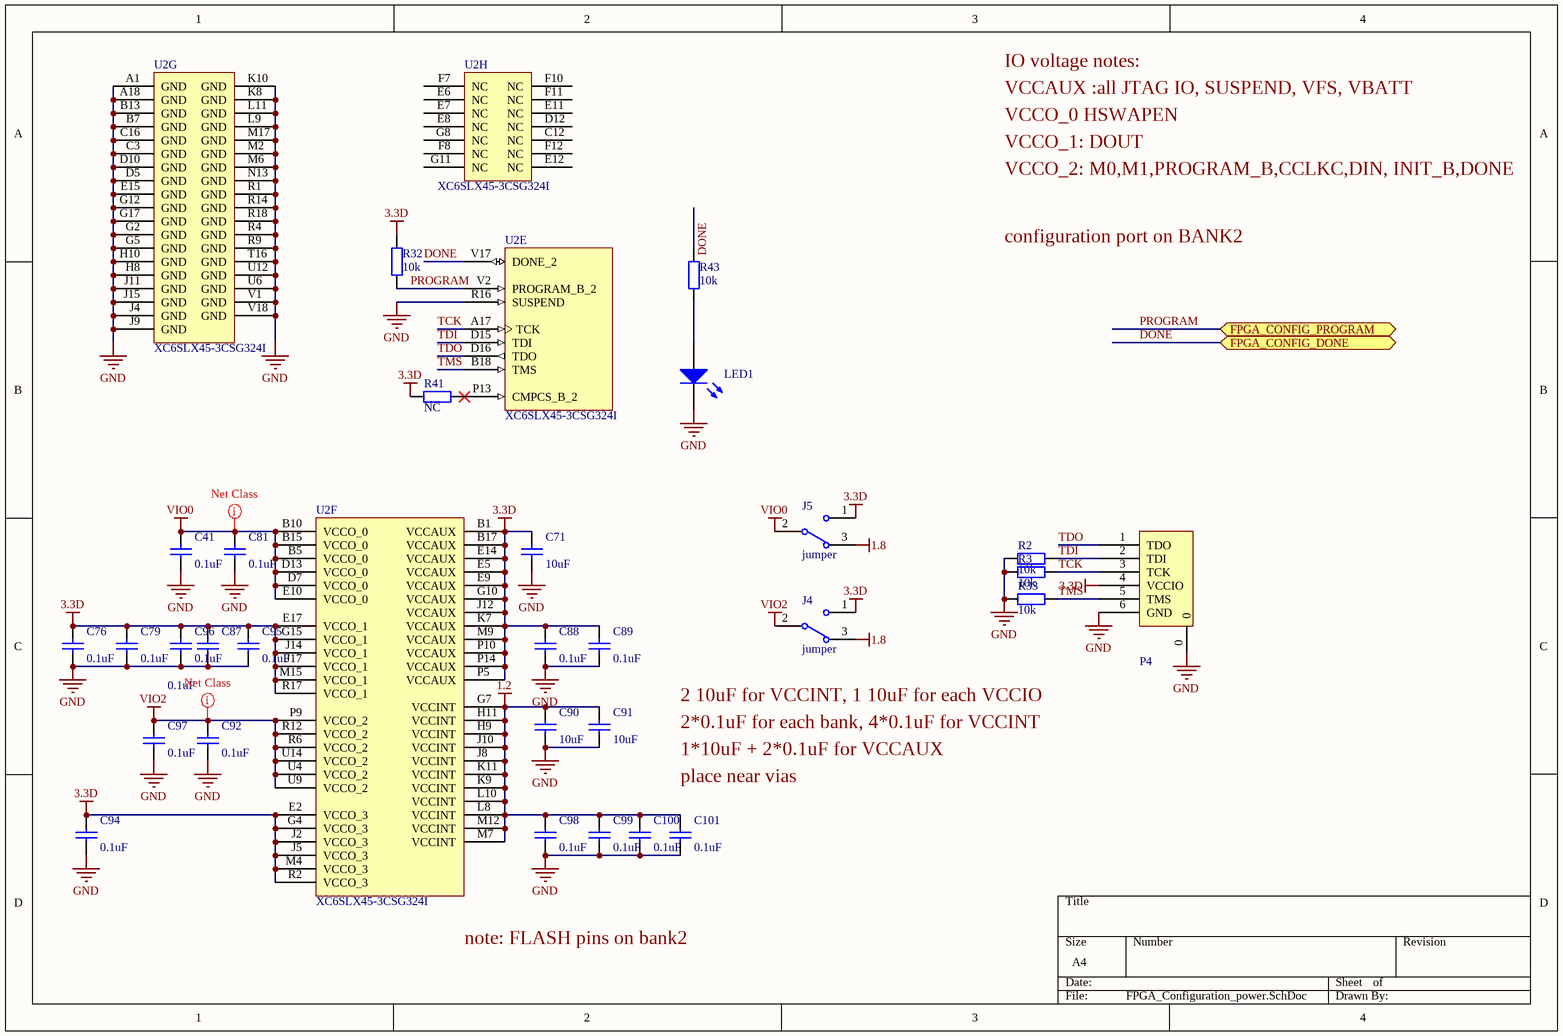
[diagram p6: FPGA_Configuration_power.SchDoc]

### Parts
C41  0.1uF  [0402]
C71  10uF  [0603L]
C76  0.1uF  [0402]
C79  0.1uF  [0402]
C81  0.1uF  [0402]
C87  0.1uF  [0402]
C88  0.1uF  [0402]
C89  0.1uF  [0402]
C90  10uF  [0603L]
C91  10uF  [0603L]
C92  0.1uF  [0402]
C94  0.1uF  [0402]
C95  0.1uF  [0402]
C96  0.1uF  [0402]
C97  0.1uF  [0402]
C98  0.1uF  [0402]
C99  0.1uF  [0402]
C100  0.1uF  [0402]
C101  0.1uF  [0402]
J4  jumper  [0402J]
J5  jumper  [0402J]
LED1  LED0  [0603]  (value not drawn)
P4  JTAG-6P  [GH1.25-6]  (value not drawn)
R2  10k  [0402]
R3  10k  [0402]
R32  10k  [0402]
R33  10k  [0402]
R41  NC  [0402]
R43  10k  [0402]
U2  XC6SLX45-3CSG324I  [CSG324]  (parts E,F,G,H of 8)

### Ports
FPGA_CONFIG_DONE, FPGA_CONFIG_PROGRAM

### Nets
1.2: C90.1 C91.1 C98.1 C99.1 C100.1 C101.1 U2.G7(VCCINT) U2.H9(VCCINT) U2.H11(VCCINT) U2.J8(VCCINT) U2.J10(VCCINT) U2.K9(VCCINT) U2.K11(VCCINT) U2.L8(VCCINT) U2.L10(VCCINT) U2.M7(VCCINT) U2.M12(VCCINT)
1.8: J4.3 J5.3
3.3D: C71.1 C76.1 C79.1 C87.1 C88.1 C89.1 C94.1 C95.1 C96.1 J4.1 J5.1 P4.4(VCCIO) R32.1 R41.2 U2.B1(VCCAUX) U2.B17(VCCAUX) U2.E2(VCCO_3) U2.E5(VCCAUX) U2.E9(VCCAUX) U2.E14(VCCAUX) U2.E17(VCCO_1) U2.G4(VCCO_3) U2.G10(VCCAUX) U2.G15(VCCO_1) U2.J2(VCCO_3) U2.J5(VCCO_3) U2.J12(VCCAUX) U2.J14(VCCO_1) U2.J17(VCCO_1) U2.K7(VCCAUX) U2.M4(VCCO_3) U2.M9(VCCAUX) U2.M15(VCCO_1) U2.P5(VCCAUX) U2.P10(VCCAUX) U2.P14(VCCAUX) U2.R2(VCCO_3) U2.R17(VCCO_1)
GND: C41.2 C71.2 C76.2 C79.2 C81.2 C87.2 C88.2 C89.2 C90.2 C91.2 C92.2 C94.2 C95.2 C96.2 C97.2 C98.2 C99.2 C100.2 C101.2 LED1.2(K) P4.0 P4.6(GND) R2.2 R3.2 R33.2 U2.A1(GND) U2.A18(GND) U2.B7(GND) U2.B13(GND) U2.C3(GND) U2.C16(GND) U2.D5(GND) U2.D10(GND) U2.E15(GND) U2.G2(GND) U2.G5(GND) U2.G12(GND) U2.G17(GND) U2.H8(GND) U2.H10(GND) U2.J4(GND) U2.J9(GND) U2.J11(GND) U2.J15(GND) U2.K8(GND) U2.K10(GND) U2.L9(GND) U2.L11(GND) U2.M2(GND) U2.M6(GND) U2.M17(GND) U2.N13(GND) U2.R1(GND) U2.R4(GND) U2.R9(GND) U2.R14(GND) U2.R16(SUSPEND) U2.R18(GND) U2.T16(GND) U2.U6(GND) U2.U12(GND) U2.V1(GND) U2.V18(GND)
VIO0: C41.1 C81.1 J5.2 U2.B5(VCCO_0) U2.B10(VCCO_0) U2.B15(VCCO_0) U2.D7(VCCO_0) U2.D13(VCCO_0) U2.E10(VCCO_0)
VIO2: C92.1 C97.1 J4.2 U2.P9(VCCO_2) U2.R6(VCCO_2) U2.R12(VCCO_2) U2.U4(VCCO_2) U2.U9(VCCO_2) U2.U14(VCCO_2)
DONE: R43.1 U2.V17(DONE_2) ; port FPGA_CONFIG_DONE
PROGRAM: R32.2 U2.V2(PROGRAM_B_2) ; port FPGA_CONFIG_PROGRAM
TCK: P4.3(TCK) R3.1 U2.A17(TCK)
TDI: P4.2(TDI) R2.1 U2.D15(TDI)
TDO: P4.1(TDO) U2.D16(TDO)
TMS: P4.5(TMS) R33.1 U2.B18(TMS)
NetLED1_1: LED1.1(A) R43.2
NetR41_1: R41.1 U2.P13(CMPCS_B_2)

Not connected (* = marked no-connect by the designer): U2 C12(NC) D12(NC) E6(NC) E7(NC) E8(NC) E11(NC) E12(NC) F7(NC) F8(NC) F10(NC) F11(NC) F12(NC) G8(NC) G11(NC)

### Layout directives
net class Power: VIO0, VIO2

### Notes on the sheet
- VCCAUX :all JTAG IO, SUSPEND, VFS, VBATT
- IO voltage notes:
- VCCO_0 HSWAPEN
- VCCO_1: DOUT
- VCCO_2: M0,M1,PROGRAM_B,CCLKC,DIN, INIT_B,DONE
- configuration port on BANK2
- (near J4) 2 10uF for VCCINT, 1 10uF for each VCCIO
- 2*0.1uF for each bank, 4*0.1uF for VCCINT
- 1*10uF + 2*0.1uF for VCCAUX
- place near vias
- (near U2) note: FLASH pins on bank2

### Library data of the parts
C41 C71 C76 C79 C81 C87-C92 C94-C101 = Cap: Capacitor; Published: 8-Jun-2000; LatestRevisionDate: 17-Jul-2002; LatestRevisionNote: Re-released for DXP Platform.; PackageReference: RAD-0.3; Publisher: Altium Limited; PackageDescription: Radial Cap, Thru-Hole; 2 Leads; 0.3 in Pin Spacing
J4 J5 = SW-SPDT: as J1 on sheet FPGA_IO_Interface; Published: 24-Mar-1999; LatestRevisionDate: 17-Dec-2003; LatestRevisionNote: Schematic revised, PCB Footprint replaced.; DatasheetVersion: 05-Dec-2000; PackageReference: TL36WW15050; Publisher: Altium Limited; PackageDescription: Switch; 4 Leads; ComponentLink1Description: Manufacturer Link; ComponentLink1URL: http://www.apem.com
LED1 = LED0: Typical INFRARED GaAs LED; Published: 8-Jun-2000; LatestRevisionDate: 08-Jul-2005; LatestRevisionNote: Mech Layer 1 removed.; PackageReference: LED-0; Publisher: Altium Limited; PackageDescription: LED; 2 Leads
R2 R3 R32 R33 R41 R43 = Res2: Resistor; Published: 8-Jun-2000; LatestRevisionDate: 17-Jul-2002; LatestRevisionNote: Re-released for DXP Platform.; PackageReference: AXIAL-0.4; Publisher: Altium Limited; PackageDescription: Axial Device, Thru-Hole; 2 Leads; 0.4 in Pin Spacing
U2 = XC6SLX45-3CSG324I: as U2 on sheet FPGA_IO_Interface; Published: 17-Nov-2009; DatasheetVersion: ver1.6, Nov-2010; PackageVersion: ver1.1, Nov-2009; PackageReference: CSG324; Publisher: Altium Limited; PackageDescription: 324-Ball Chip-Scale BGA (CSG324) Package, 0.8 mm Pitch; Supplier 1: Digi-Key; Supplier Part Number 1: XC6SLX45-3CSG324I-ND; Code_JEDEC: MO-275-KKAC-1; ComponentLink1Description: Manufacturer Link; ComponentLink1URL: http://www.xilinx.com; ComponentLink2Description: Spartan-6 Datasheet; ComponentLink2URL: http://www.xilinx.com/support/documentation/data_sheets/ds160.pdf; ComponentLink3Description: Spartan-6 Documents; ComponentLink3URL: http://www.xilinx.com/support/documentation/spartan-6.htm; ComponentLink4Description: Xilinx.com Home; ComponentLink4URL: http://www.xilinx.com

## Sheet connector.SchDoc
size A4
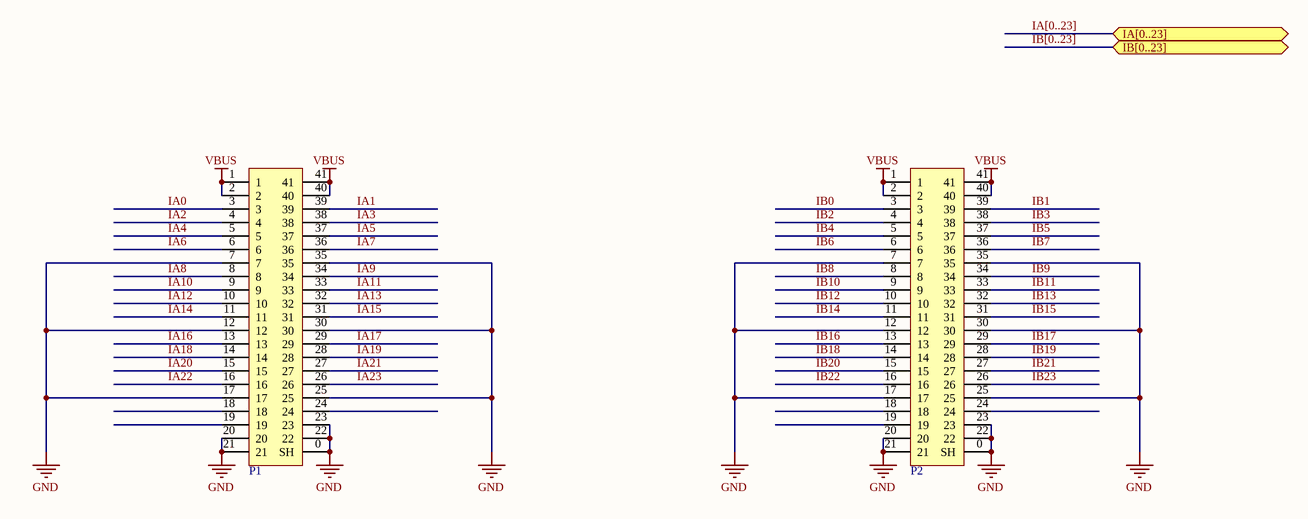
[diagram p7: connector.SchDoc]

### Parts
P1  DF9-41S  [DF9-41S]  (value not drawn)
P2  DF9-41S  [DF9-41S]  (value not drawn)

### Ports
IA[0..23], IB[0..23]

### Nets
GND: P1.0(SH) P1.7 P1.12 P1.17 P1.20 P1.21 P1.22 P1.23 P1.25 P1.30 P1.35 P2.0(SH) P2.7 P2.12 P2.17 P2.20 P2.21 P2.22 P2.23 P2.25 P2.30 P2.35
VBUS: P1.1 P1.2 P1.40 P1.41 P2.1 P2.2 P2.40 P2.41
IA0: P1.3
IA1: P1.39
IA2: P1.4
IA3: P1.38
IA4: P1.5
IA5: P1.37
IA6: P1.6
IA7: P1.36
IA8: P1.8
IA9: P1.34
IA10: P1.9
IA11: P1.33
IA12: P1.10
IA13: P1.32
IA14: P1.11
IA15: P1.31
IA16: P1.13
IA17: P1.29
IA18: P1.14
IA19: P1.28
IA20: P1.15
IA21: P1.27
IA22: P1.16
IA23: P1.26
IB0: P2.3
IB1: P2.39
IB2: P2.4
IB3: P2.38
IB4: P2.5
IB5: P2.37
IB6: P2.6
IB7: P2.36
IB8: P2.8
IB9: P2.34
IB10: P2.9
IB11: P2.33
IB12: P2.10
IB13: P2.32
IB14: P2.11
IB15: P2.31
IB16: P2.13
IB17: P2.29
IB18: P2.14
IB19: P2.28
IB20: P2.15
IB21: P2.27
IB22: P2.16
IB23: P2.26

Not connected (* = marked no-connect by the designer): P1 18 19 24; P2 18 19 24

### Buses and harness runs
bus IA[0..23] = port IA[0..23]
bus IB[0..23] = port IB[0..23]

## Nets that join several sheets
1.2: power (C54.2 L17.2 R11.2 U3.4), CYUSB (21 pins), FPGA_Configuration_power (17 pins)
1.8: power (C27.2 U5.3), FPGA_Configuration_power (J4.3 J5.3)
3.3D: power (7 pins), USB_TYPE_C (6 pins), CYUSB_IO (R26.1 R27.1 R28.1), CYUSB (19 pins), FPGA_IO_Interface (8 pins), FPGA_Configuration_power (38 pins)
GND: power (14 pins), USB_TYPE_C (19 pins), CYUSB_IO (C13.1 R15.2 R16.2), CYUSB (50 pins), FPGA_IO_Interface (7 pins), FPGA_Configuration_power (63 pins), connector (22 pins)
VBUS: power (5 pins), USB_TYPE_C (6 pins), CYUSB_IO (C13.2 U1.E11), connector (8 pins)
CCLK: CYUSB_IO (U1.D4), FPGA_IO_Interface (U2.R15 U8.6)
CTL0: CYUSB_IO (U1.K8), FPGA_IO_CYUSB (U2.L18)
CTL1: CYUSB_IO (U1.K7), FPGA_IO_CYUSB (U2.K17)
CTL2: CYUSB_IO (U1.J7), FPGA_IO_CYUSB (U2.K15)
CTL3: CYUSB_IO (U1.H7), FPGA_IO_CYUSB (U2.K16)
CTL4: CYUSB_IO (U1.G7), FPGA_IO_CYUSB (U2.N15)
CTL5: CYUSB_IO (U1.G6), FPGA_IO_CYUSB (U2.N14)
CTL6: CYUSB_IO (U1.K6), FPGA_IO_CYUSB (U2.K18)
CTL7: CYUSB_IO (U1.H8), FPGA_IO_CYUSB (U2.K14)
CTL8: CYUSB_IO (U1.G5), FPGA_IO_CYUSB (U2.G14)
CTL9: CYUSB_IO (U1.H6), FPGA_IO_CYUSB (U2.L14)
CTL10: CYUSB_IO (U1.K5), FPGA_IO_CYUSB (U2.J18)
CTL11: CYUSB_IO (U1.J5), FPGA_IO_CYUSB (U2.J16)
CTL12: CYUSB_IO (U1.H5), FPGA_IO_CYUSB (U2.H15)
DATA: CYUSB_IO (U1.D5), FPGA_IO_Interface (U2.R13 U8.2)
DONE: CYUSB_IO (U1.D1), FPGA_Configuration_power (R43.1 U2.V17)
DQ0: CYUSB_IO (U1.F10), FPGA_IO_CYUSB (U2.U17)
DQ1: CYUSB_IO (U1.F9), FPGA_IO_CYUSB (U2.T17)
DQ2: CYUSB_IO (U1.F7), FPGA_IO_CYUSB (U2.P15)
DQ3: CYUSB_IO (U1.G10), FPGA_IO_CYUSB (U2.P18)
DQ4: CYUSB_IO (U1.G9), FPGA_IO_CYUSB (U2.N16)
DQ5: CYUSB_IO (U1.F8), FPGA_IO_CYUSB (U2.T18)
DQ6: CYUSB_IO (U1.H10), FPGA_IO_CYUSB (U2.U18)
DQ7: CYUSB_IO (U1.H9), FPGA_IO_CYUSB (U2.M16)
DQ8: CYUSB_IO (U1.J10), FPGA_IO_CYUSB (U2.P17)
DQ9: CYUSB_IO (U1.J9), FPGA_IO_CYUSB (U2.L15)
DQ10: CYUSB_IO (U1.K11), FPGA_IO_CYUSB (U2.N17)
DQ11: CYUSB_IO (U1.L10), FPGA_IO_CYUSB (U2.N18)
DQ12: CYUSB_IO (U1.K10), FPGA_IO_CYUSB (U2.M18)
DQ13: CYUSB_IO (U1.K9), FPGA_IO_CYUSB (U2.L17)
DQ14: CYUSB_IO (U1.J8), FPGA_IO_CYUSB (U2.L16)
DQ15: CYUSB_IO (U1.G8), FPGA_IO_CYUSB (U2.M14)
DQ16: CYUSB_IO (U1.K2), FPGA_IO_CYUSB (U2.H17)
DQ17: CYUSB_IO (U1.J4), FPGA_IO_CYUSB (U2.H16)
DQ18: CYUSB_IO (U1.K1), FPGA_IO_CYUSB (U2.F17)
DQ19: CYUSB_IO (U1.J2), FPGA_IO_CYUSB (U2.F18)
DQ20: CYUSB_IO (U1.J3), FPGA_IO_CYUSB (U2.G18)
DQ21: CYUSB_IO (U1.J1), FPGA_IO_CYUSB (U2.E18)
DQ22: CYUSB_IO (U1.H2), FPGA_IO_CYUSB (U2.D17)
DQ23: CYUSB_IO (U1.H3), FPGA_IO_CYUSB (U2.H14)
DQ24: CYUSB_IO (U1.F4), FPGA_IO_CYUSB (U2.F15)
DQ25: CYUSB_IO (U1.G2), FPGA_IO_CYUSB (U2.C18)
DQ26: CYUSB_IO (U1.G3), FPGA_IO_CYUSB (U2.G16)
DQ27: CYUSB_IO (U1.F3), FPGA_IO_CYUSB (U2.E16)
DQ28: CYUSB_IO (U1.F5), FPGA_IO_CYUSB (U2.F16)
DQ29: CYUSB_IO (U1.E1), FPGA_IO_CYUSB (U2.F14)
DQ30: CYUSB_IO (U1.E5), FPGA_IO_CYUSB (U2.C17)
DQ31: CYUSB_IO (U1.E4), FPGA_IO_CYUSB (U2.D18)
IA0: FPGA_IO_Interface (U2.B3), connector (P1.3)
IA1: FPGA_IO_Interface (U2.A2), connector (P1.39)
IA2: FPGA_IO_Interface (U2.B4), connector (P1.4)
IA3: FPGA_IO_Interface (U2.B2), connector (P1.38)
IA4: FPGA_IO_Interface (U2.A6), connector (P1.5)
IA5: FPGA_IO_Interface (U2.A3), connector (P1.37)
IA6: FPGA_IO_Interface (U2.A7), connector (P1.6)
IA7: FPGA_IO_Interface (U2.A4), connector (P1.36)
IA8: FPGA_IO_Interface (U2.B8), connector (P1.8)
IA9: FPGA_IO_Interface (U2.A5), connector (P1.34)
IA10: FPGA_IO_Interface (U2.B9), connector (P1.9)
IA11: FPGA_IO_Interface (U2.B6), connector (P1.33)
IA12: FPGA_IO_Interface (U2.A11), connector (P1.10)
IA13: FPGA_IO_Interface (U2.A8), connector (P1.32)
IA14: FPGA_IO_Interface (U2.A12), connector (P1.11)
IA15: FPGA_IO_Interface (U2.A9), connector (P1.31)
IA16: FPGA_IO_Interface (U2.A14), connector (P1.13)
IA17: FPGA_IO_Interface (U2.A10), connector (P1.29)
IA18: FPGA_IO_Interface (U2.B14), connector (P1.14)
IA19: FPGA_IO_Interface (U2.B11), connector (P1.28)
IA20: FPGA_IO_Interface (U2.A15), connector (P1.15)
IA21: FPGA_IO_Interface (U2.B12), connector (P1.27)
IA22: FPGA_IO_Interface (U2.B16), connector (P1.16)
IA23: FPGA_IO_Interface (U2.A13), connector (P1.26)
IB0: FPGA_IO_Interface (U2.U16), connector (P2.3)
IB1: FPGA_IO_Interface (U2.U15), connector (P2.39)
IB2: FPGA_IO_Interface (U2.V16), connector (P2.4)
IB3: FPGA_IO_Interface (U2.T11), connector (P2.38)
IB4: FPGA_IO_Interface (U2.T12), connector (P2.5)
IB5: FPGA_IO_Interface (U2.V14), connector (P2.37)
IB6: FPGA_IO_Interface (U2.T14), connector (P2.6)
IB7: FPGA_IO_Interface (U2.V13), connector (P2.36)
IB8: FPGA_IO_Interface (U2.V15), connector (P2.8)
IB9: FPGA_IO_Interface (U2.U11), connector (P2.34)
IB10: FPGA_IO_Interface (U2.U13), connector (P2.9)
IB11: FPGA_IO_Interface (U2.U10), connector (P2.33)
IB12: FPGA_IO_Interface (U2.V12), connector (P2.10)
IB13: FPGA_IO_Interface (U2.T8), connector (P2.32)
IB14: FPGA_IO_Interface (U2.V11), connector (P2.11)
IB15: FPGA_IO_Interface (U2.V10), connector (P2.31)
IB16: FPGA_IO_Interface (U2.T9), connector (P2.13)
IB17: FPGA_IO_Interface (U2.V6), connector (P2.29)
IB18: FPGA_IO_Interface (U2.U8), connector (P2.14)
IB19: FPGA_IO_Interface (U2.U5), connector (P2.28)
IB20: FPGA_IO_Interface (U2.U7), connector (P2.15)
IB21: FPGA_IO_Interface (U2.V5), connector (P2.27)
IB22: FPGA_IO_Interface (U2.V7), connector (P2.16)
IB23: FPGA_IO_Interface (U2.V4), connector (P2.26)
INIT_B: CYUSB_IO (U1.D3), FPGA_IO_Interface (U2.U3)
INT_CYUSB: CYUSB_IO (U1.L8), FPGA_IO_CYUSB (U2.M13)
NetP5_6: USB_TYPE_C (P5.6 P5.B6 U6.2), CYUSB_IO (U1.A9)
NetP5_7: USB_TYPE_C (P5.7 P5.B7 U6.1), CYUSB_IO (U1.A10)
NetR4_1: USB_TYPE_C (R21.1 U4.26), CYUSB (R4.1 U1.D9 U10.6)
NetR18_1: USB_TYPE_C (R20.1 U4.25), CYUSB (R18.1 U1.D10 U10.5)
NetU1_A3: USB_TYPE_C (U4.10), CYUSB_IO (U1.A3)
NetU1_A4: USB_TYPE_C (U4.9), CYUSB_IO (U1.A4)
NetU1_A5: USB_TYPE_C (U4.6), CYUSB_IO (U1.A5)
NetU1_A6: USB_TYPE_C (U4.7), CYUSB_IO (U1.A6)
PCLK: CYUSB_IO (U1.J6), FPGA_IO_CYUSB (U2.L13)
PROGRAM: CYUSB_IO (U1.C1), FPGA_Configuration_power (R32.2 U2.V2)